# Altium schematic sheet actuators.SchDoc: Actuators
size A4; CheckedBy: None; CompanyName: ETSIT; DrawnBy: David, Andrea; DocumentNumber: 5; SheetNumber: 5; SheetTotal: 7; TotalSheet: 7; VersionRevision: v1.0; Project: Hefesto; Company: ETSIT
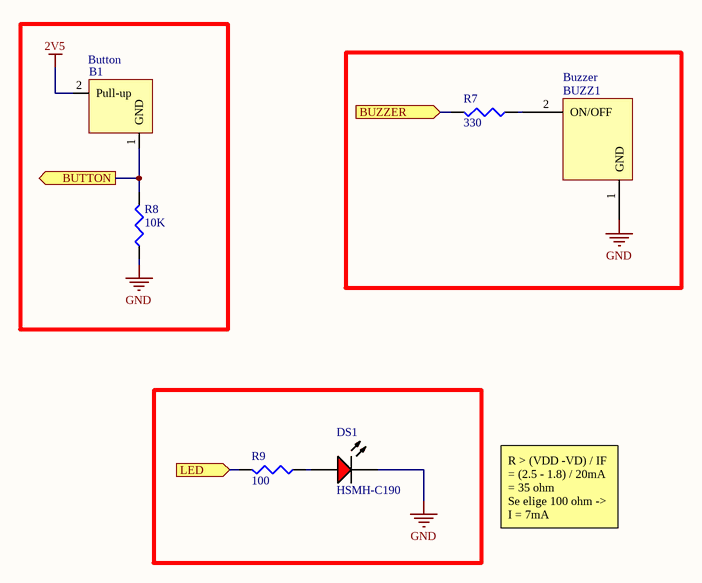
[diagram p0: actuators.SchDoc]

## Parts
B1  Button  [Button]
BUZZ1  Buzzer  [SOP_Buzzer]
DS1  HSMH-C190  [AVAG-HSMX-C190_V]
R7  value 330  [J1-0603]  (hidden comment: Res3)
R8  value 10K  [J1-0603]  (hidden comment: Res3)
R9  value 100  [J1-0603]  (hidden comment: Res3)

## Ports
BUTTON (out, see main[4B]), BUZZER (in, see main[4B]), LED (in, see main[4B])

## Nets
2V5: B1.2(Pull-up)
GND: BUZZ1.1(GND) DS1.2(K) R8.1
BUTTON: B1.1(GND) R8.2 ; port BUTTON
BUZZER: R7.2 ; port BUZZER
LED: R9.2 ; port LED
NetBUZZ1_2: BUZZ1.2(ON/OFF) R7.1
NetDS1_1: DS1.1(A) R9.1

## Notes on the sheet
- R > (VDD -VD) / IF = (2.5 - 1.8) / 20mA = 35 ohm                                       Se elige 100 ohm -> I = 7mA
- Title:
- Drawn By:
- Page Contents:
- Checked By:
- Size:
- Date:
- File:
- License:
- Email:
- A4
- Number:
- Time:
- Revision:
- Sheet
- Website:
- of

## Library data of the parts
DS1 = CMP-1744-00004-1: LED Uni-Color Red, 65 mW, 20 mA, -40 to 85 degC, 2-Pin SMD, RoHS, Tape and Reel; Connector Type: USB; Gender: Male; Current Rating: 1 A; Length: 7.5 mm; Lead Pitch: 0.65 mm; PackageReference: HSMX-C190; Package Quantity: 2000; Max Operating Temperature: 85 degC; PackageDescription: 2-Pin Surface Mount Device, Body 1.6 x 0.8 mm, Height 0.9 mm; ComponentLink3Description: Package Specification; Mount: Surface Mount; Min Operating Temperature: -30 degC; ComponentLink3URL: http://www.fairchildsemi.com/dwg/MA/MA03D.pdf; ComponentLink1Description: Manufacturer URL; Contact Material: Copper; Pins: 5; Width: 5.6 mm; ComponentLink2Description: Datasheet; RoHSCompliant: true; DatasheetVersion: Mar-12; Height: 2.8 mm; Packaging: Tape and Reel; Contact Plating: Gold; ComponentLink1URL: http://www.avagotech.com/; REACH SVHC: No SVHC; ComponentLink2URL: http://docs.avagotech.com/docs/AV02-0551EN
R7-R9 = Res3: Resistor; Published: 8-Jun-2000; LatestRevisionDate: 29-May-2009; LatestRevisionNote: IPC-7351 Footprint Added.; PackageReference: J1-0603; Publisher: Altium Limited; PackageDescription: Chip Resistor